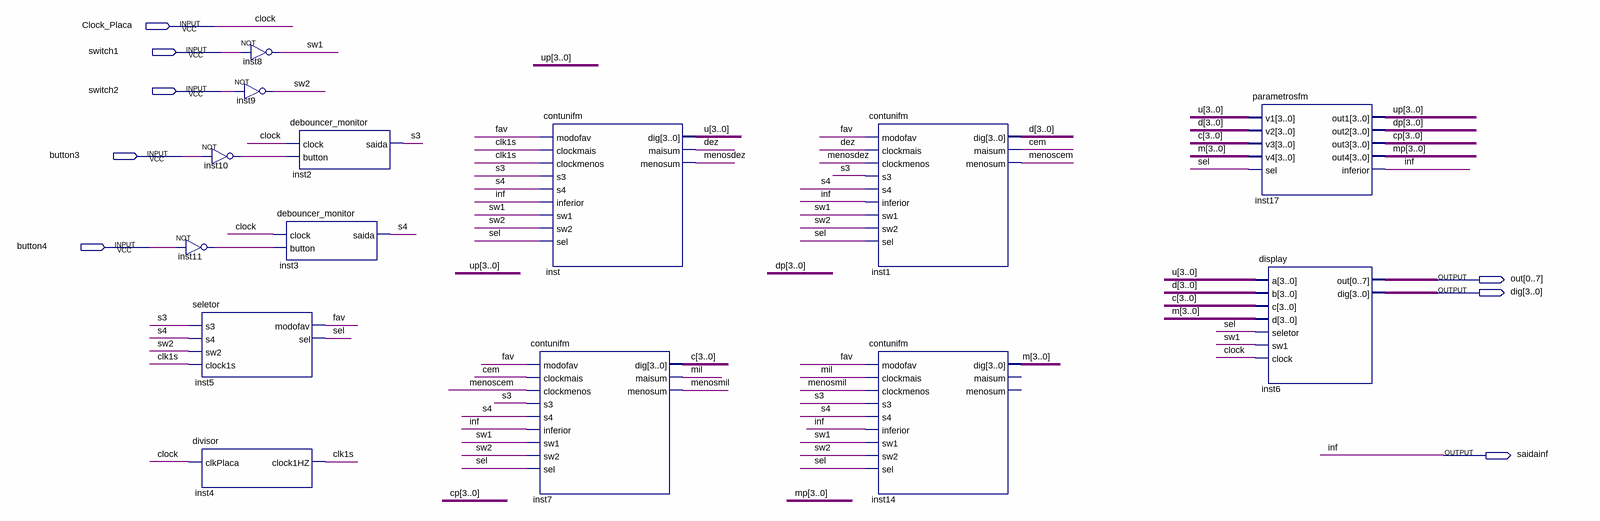
[diagram p0: schematic sheet]
// Quartus schematic testecont.bdf as structural Verilog: 14 symbols, 8 pins
module testecont (
  input  Clock_Placa,
  input  switch1,
  input  switch2,
  input  button3,
  input  button4,
  output [0:7] out,
  output [3:0] dig,
  output saidainf
);

  wire cem, clk1s, dez, fav, inst10_out, inst11_out, menoscem, menosdez, menosmil, mil, s3, s4, sel, sw1, sw2;
  wire [3:0] c, cp, d, dp, m, mp, u, up;

  not inst11 (inst11_out, button4);
  not inst10 (inst10_out, button3);
  seletor inst5 (.s3(s3), .s4(s4), .sw2(sw2), .clock1s(clk1s), .modofav(fav), .sel(sel));
  divisor inst4 (.clkPlaca(Clock_Placa), .clock1HZ(clk1s));
  not inst8 (sw1, switch1);
  not inst9 (sw2, switch2);
  debouncer_monitor inst3 (.clock(Clock_Placa), .button(inst11_out), .saida(s4));
  debouncer_monitor inst2 (.clock(Clock_Placa), .button(inst10_out), .saida(s3));
  contunifm inst (
    .modofav(fav), .clockmais(clk1s), .clockmenos(clk1s), .s3(s3), .s4(s4), .inferior(saidainf), .sw1(sw1),
    .sw2(sw2), .sel(sel), .dig(u), .maisum(dez), .menosum(menosdez));
  contunifm inst7 (
    .modofav(fav), .clockmais(cem), .clockmenos(menoscem), .s3(s3), .s4(s4), .inferior(saidainf), .sw1(sw1),
    .sw2(sw2), .sel(sel), .dig(c), .maisum(mil), .menosum(menosmil));
  contunifm inst1 (
    .modofav(fav), .clockmais(dez), .clockmenos(menosdez), .s3(s3), .s4(s4), .inferior(saidainf), .sw1(sw1),
    .sw2(sw2), .sel(sel), .dig(d), .maisum(cem), .menosum(menoscem));
  contunifm inst14 (
    .modofav(fav), .clockmais(mil), .clockmenos(menosmil), .s3(s3), .s4(s4), .inferior(saidainf), .sw1(sw1),
    .sw2(sw2), .sel(sel), .dig(m));  // open: maisum, menosum
  parametrosfm inst17 (
    .v1(u), .v2(d), .v3(c), .v4(m), .sel(sel), .out1(up), .out2(dp), .out3(cp), .out4(mp), .inferior(saidainf));
  display inst6 (.a(u), .b(d), .c(c), .d(m), .seletor(sel), .sw1(sw1), .clock(Clock_Placa), .out(out), .dig(dig));

  // Other names for the same wires on the sheet: clock = Clock_Placa; inf = saidainf
endmodule
